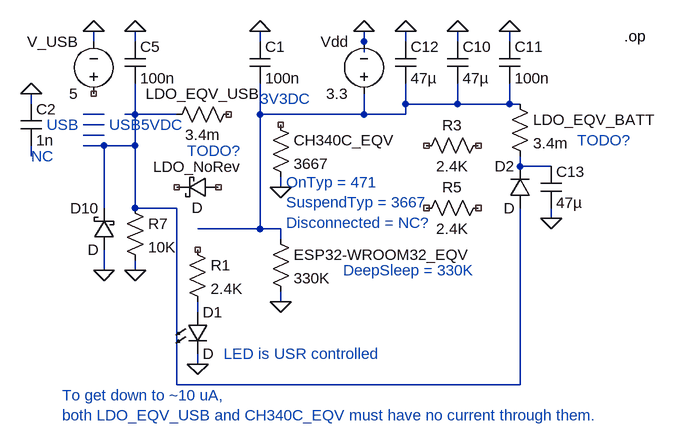
[diagram p0: schematic DFR0478_FireBeetleBoard-ESP32-v4.0_LTSpice.asc]
DFR0478_FireBeetleBoard-ESP32-v4.0_LTSpice.asc, the LTspice schematic file:
Version 4.1
SHEET 1 1364 680
WIRE 352 -48 352 -64
WIRE 416 -48 416 -64
WIRE 608 -48 608 -64
WIRE 768 -48 768 -64
WIRE 832 -48 832 -64
WIRE 912 -48 912 -64
WIRE 992 -48 992 -64
WIRE 768 -32 768 -48
WIRE 256 48 256 32
WIRE 832 48 832 16
WIRE 912 48 912 16
WIRE 912 48 832 48
WIRE 992 48 992 16
WIRE 992 48 912 48
WIRE 1008 48 992 48
WIRE 368 64 336 64
WIRE 416 64 416 16
WIRE 416 64 400 64
WIRE 480 64 416 64
WIRE 608 64 608 16
WIRE 768 64 768 32
WIRE 768 64 608 64
WIRE 832 64 832 48
WIRE 832 64 768 64
WIRE 368 80 336 80
WIRE 368 96 336 96
WIRE 368 112 336 112
WIRE 416 112 416 64
WIRE 416 112 368 112
WIRE 256 128 256 112
WIRE 1008 144 1008 128
WIRE 1056 144 1008 144
WIRE 640 176 640 160
WIRE 368 208 368 112
WIRE 416 208 416 112
WIRE 480 208 416 208
WIRE 1056 224 1056 208
WIRE 608 240 608 64
WIRE 608 240 512 240
WIRE 640 240 608 240
WIRE 640 256 640 240
WIRE 368 304 368 272
WIRE 416 304 416 288
WIRE 640 352 640 336
WIRE 512 368 512 352
WIRE 512 448 512 432
WIRE 480 480 480 208
WIRE 1008 480 1008 208
WIRE 1008 480 480 480
FLAG 256 32 0
FLAG 368 304 0
FLAG 416 304 0
FLAG 416 -64 0
FLAG 608 -64 0
FLAG 640 176 0
FLAG 768 -64 0
FLAG 640 352 0
FLAG 512 448 0
FLAG 832 -64 0
FLAG 912 -64 0
FLAG 992 -64 0
FLAG 1056 224 0
FLAG 352 -64 0
SYMBOL cap 240 48 R0
SYMATTR InstName C2
SYMATTR Value 1n
SYMBOL res 400 192 R0
SYMATTR InstName R7
SYMATTR Value 10K
SYMBOL cap 400 -48 R0
SYMATTR InstName C5
SYMATTR Value 100n
SYMBOL cap 592 -48 R0
SYMATTR InstName C1
SYMATTR Value 100n
SYMBOL res 464 80 R270
WINDOW 0 32 56 VTop 2
WINDOW 3 0 56 VBottom 2
SYMATTR InstName LDO_EQV_USB
SYMATTR Value 3.4m
SYMBOL res 960 96 R90
WINDOW 0 0 56 VBottom 2
WINDOW 3 32 56 VTop 2
SYMATTR InstName R3
SYMATTR Value 2.4K
SYMBOL res 960 192 R90
WINDOW 0 0 56 VBottom 2
WINDOW 3 32 56 VTop 2
SYMATTR InstName R5
SYMATTR Value 2.4K
SYMBOL res 624 64 R0
SYMATTR InstName CH340C_EQV
SYMATTR Value 3667
SYMBOL voltage 768 48 R180
WINDOW 0 24 96 Left 2
WINDOW 3 24 16 Left 2
SYMATTR InstName Vdd
SYMATTR Value 3.3
SYMBOL res 624 240 R0
SYMATTR InstName ESP32-WROOM32_EQV
SYMATTR Value 330K
SYMBOL res 496 256 R0
SYMATTR InstName R1
SYMATTR Value 2.4K
SYMBOL LED 496 368 R0
SYMATTR InstName D1
SYMBOL cap 816 -48 R0
SYMATTR InstName C12
SYMATTR Value 47µ
SYMBOL cap 896 -48 R0
SYMATTR InstName C10
SYMATTR Value 47µ
SYMBOL cap 976 -48 R0
SYMATTR InstName C11
SYMATTR Value 100n
SYMBOL res 992 32 R0
SYMATTR InstName LDO_EQV_BATT
SYMATTR Value 3.4m
SYMBOL diode 1024 208 R180
WINDOW 0 24 64 Left 2
WINDOW 3 24 0 Left 2
SYMATTR InstName D2
SYMBOL cap 1040 144 R0
SYMATTR InstName C13
SYMATTR Value 47µ
SYMBOL voltage 352 48 R180
WINDOW 0 24 96 Left 2
WINDOW 3 24 16 Left 2
SYMATTR InstName V_USB
SYMATTR Value 5
SYMBOL schottky 544 160 R90
WINDOW 0 0 32 VBottom 2
WINDOW 3 32 32 VTop 2
SYMATTR InstName LDO_NoRev
SYMBOL schottky 384 272 R180
WINDOW 0 24 64 Left 2
WINDOW 3 24 0 Left 2
SYMATTR InstName D10
TEXT 256 128 Left 2 ;NC
TEXT 280 80 Left 2 ;USB
TEXT 608 40 Left 2 ;3V3DC
TEXT 376 80 Left 2 ;USB5VDC
TEXT 1168 -56 Left 2 !.op
TEXT 736 304 Left 2 ;DeepSleep = 330K
TEXT 648 168 Left 2 ;OnTyp = 471\nSuspendTyp = 3667\nDisconnected = NC?
TEXT 1096 104 Left 2 ;TODO?
TEXT 496 120 Left 2 ;TODO?
TEXT 552 432 Left 2 ;LED is USR controlled
TEXT 304 496 Left 2 ;To get down to ~10 uA,\nboth LDO_EQV_USB and CH340C_EQV must have no current through them.

The netlist it stands for:
* DFR0478_FireBeetleBoard-ESP32-v4.0_LTSpice.asc
C2 0 N006 1n
R7 N003 0 10K
C5 0 N003 100n
C1 0 N001 100n
R§LDO_EQV_USB N003 NC_01 3.4m
R3 NC_02 NC_03 2.4K
R5 NC_04 NC_05 2.4K
R§CH340C_EQV NC_06 0 3667
Vdd N001 0 3.3
R§ESP32-WROOM32_EQV N001 0 330K
R1 NC_07 N008 2.4K
D1 N008 0 D
C12 0 N001 47µ
C10 0 N001 47µ
C11 0 N001 100n
R§LDO_EQV_BATT N001 N007 3.4m
D2 N003 N007 D
C13 N007 0 47µ
V_USB NC_08 0 5
D§LDO_NoRev NC_09 NC_10 D
D10 0 N003 D
.model D D
.lib standard.dio
* NC
* USB
* 3V3DC
* USB5VDC
.op
* DeepSleep = 330K
* OnTyp = 471
* SuspendTyp = 3667
* Disconnected = NC?
* TODO?
* TODO?
* LED is USR controlled
* To get down to ~10 uA,
* both LDO_EQV_USB and CH340C_EQV must have no current through them.
.backanno
.end